# Altium schematic sheet Drivers.SchDoc
size A
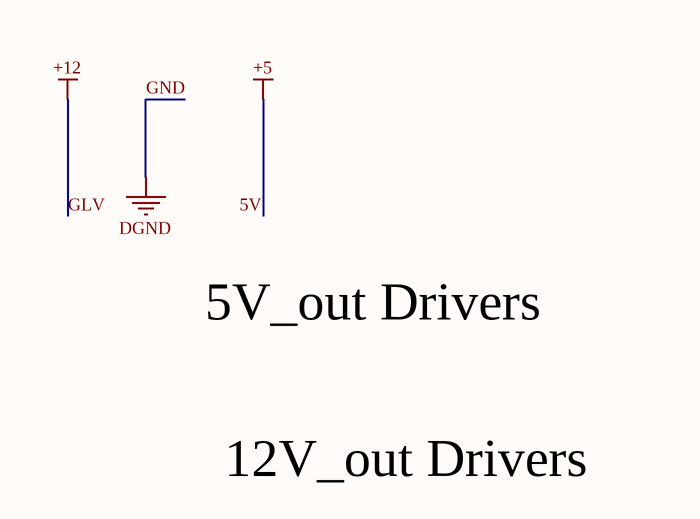
[diagram p0: Drivers.SchDoc]

## Notes on the sheet
- 5V_out Drivers
- 12V_out Drivers